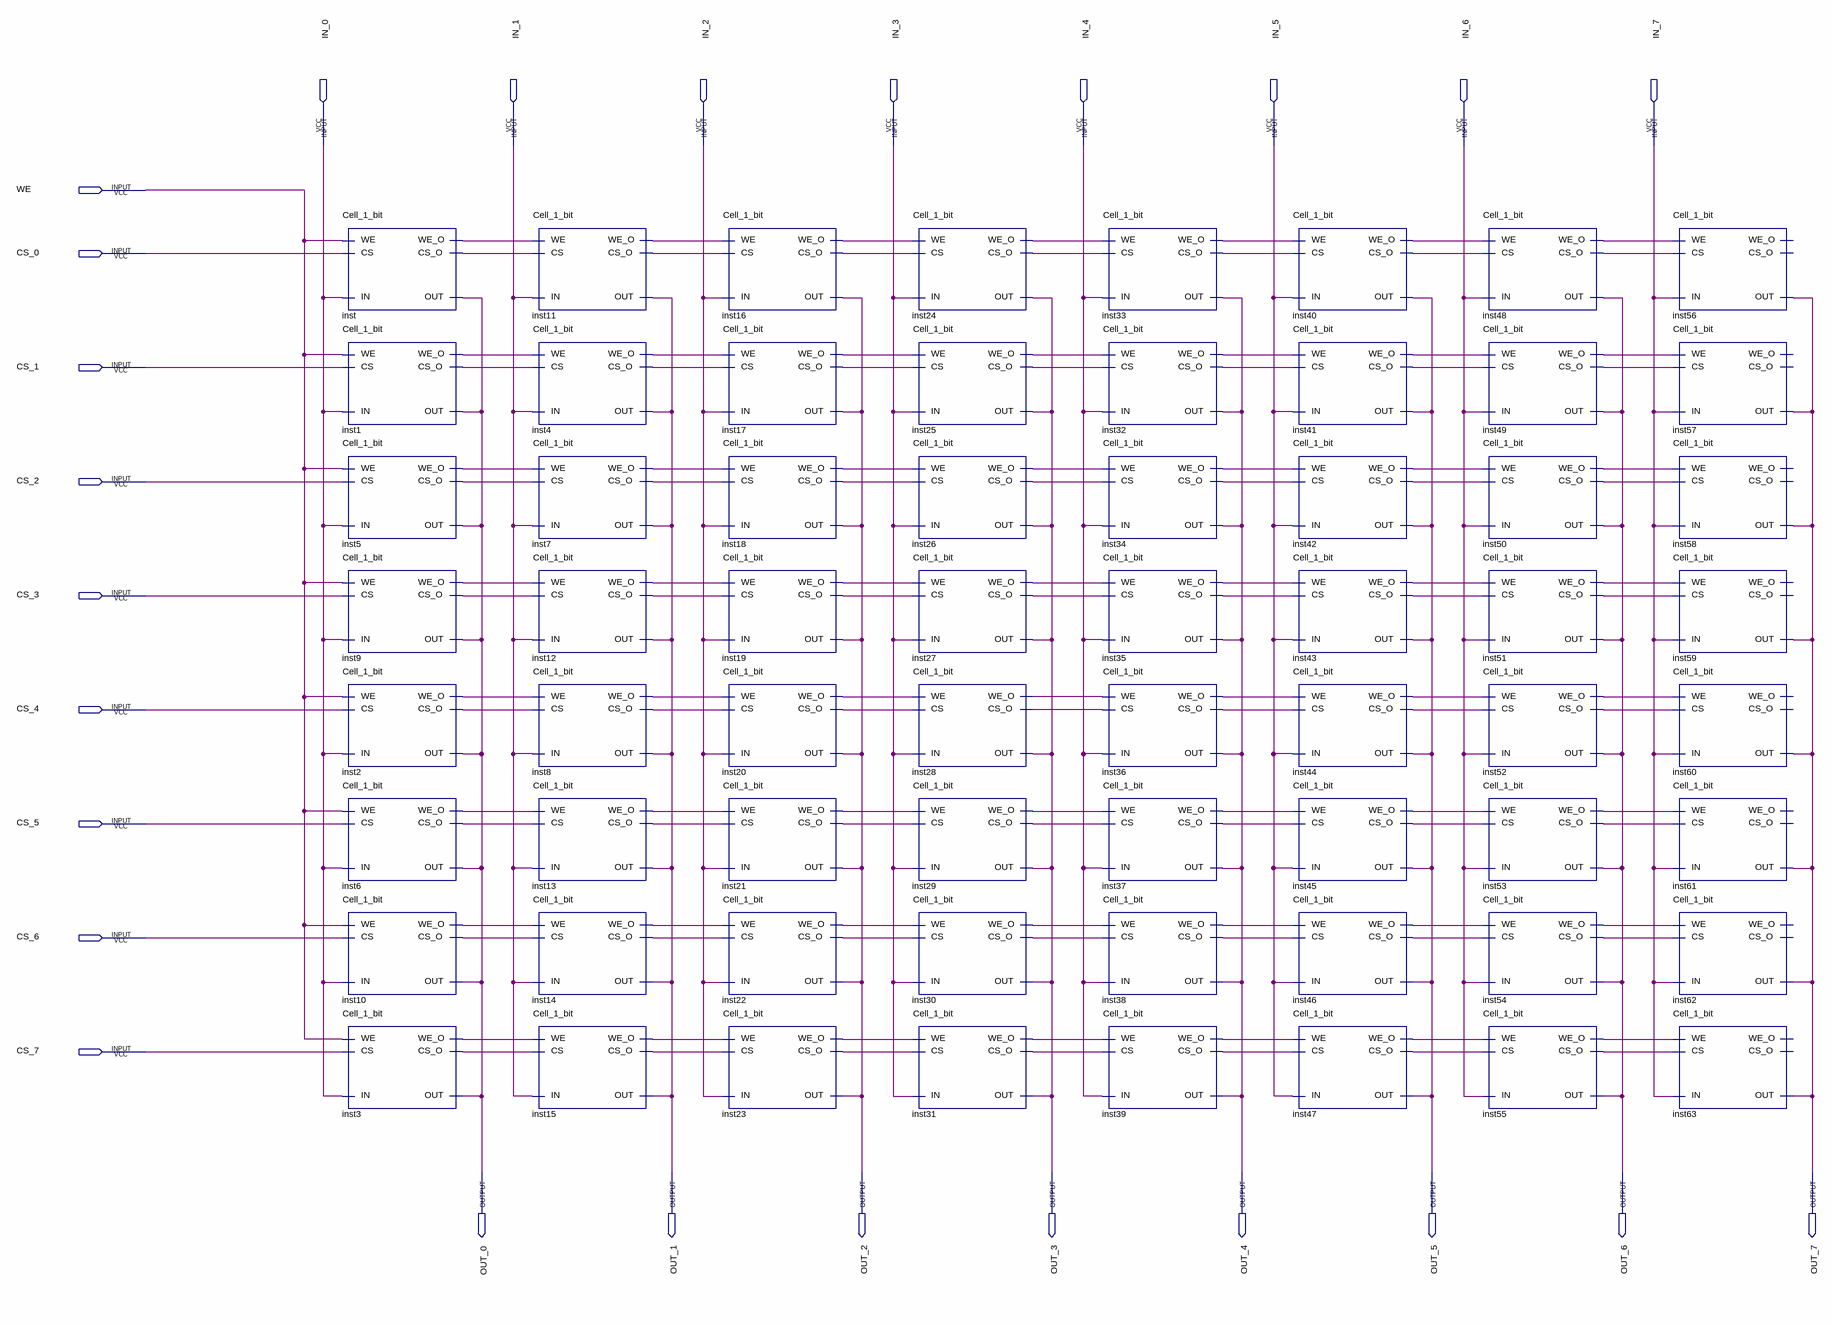
[diagram p0: schematic sheet]
// Quartus schematic Cell_8x8_bits.bdf as structural Verilog: 64 symbols, 25 pins
module Cell_8x8_bits (
  input  IN_0,
  input  IN_1,
  input  IN_2,
  input  IN_3,
  input  IN_4,
  input  IN_5,
  input  IN_6,
  input  IN_7,
  input  WE,
  input  CS_0,
  input  CS_1,
  input  CS_2,
  input  CS_3,
  input  CS_4,
  input  CS_5,
  input  CS_6,
  input  CS_7,
  output OUT_0,
  output OUT_1,
  output OUT_2,
  output OUT_3,
  output OUT_4,
  output OUT_5,
  output OUT_6,
  output OUT_7
);

  wire inst1_cs_o, inst1_we_o, inst2_cs_o, inst2_we_o, inst3_cs_o, inst3_we_o, inst4_cs_o, inst4_we_o,
       inst5_cs_o, inst5_we_o, inst6_cs_o, inst6_we_o, inst7_cs_o, inst7_we_o, inst8_cs_o, inst8_we_o,
       inst9_cs_o, inst9_we_o, inst10_cs_o, inst10_we_o, inst11_cs_o, inst11_we_o, inst12_cs_o, inst12_we_o,
       inst13_cs_o, inst13_we_o, inst14_cs_o, inst14_we_o, inst15_cs_o, inst15_we_o, inst16_cs_o,
       inst16_we_o, inst17_cs_o, inst17_we_o, inst18_cs_o, inst18_we_o, inst19_cs_o, inst19_we_o,
       inst20_cs_o, inst20_we_o, inst21_cs_o, inst21_we_o, inst22_cs_o, inst22_we_o, inst23_cs_o,
       inst23_we_o, inst24_cs_o, inst24_we_o, inst25_cs_o, inst25_we_o, inst26_cs_o, inst26_we_o,
       inst27_cs_o, inst27_we_o, inst28_cs_o, inst28_we_o, inst29_cs_o, inst29_we_o, inst30_cs_o,
       inst30_we_o, inst31_cs_o, inst31_we_o, inst32_cs_o, inst32_we_o, inst33_cs_o, inst33_we_o,
       inst34_cs_o, inst34_we_o, inst35_cs_o, inst35_we_o, inst36_cs_o, inst36_we_o, inst37_cs_o,
       inst37_we_o, inst38_cs_o, inst38_we_o, inst39_cs_o, inst39_we_o, inst40_cs_o, inst40_we_o,
       inst41_cs_o, inst41_we_o, inst42_cs_o, inst42_we_o, inst43_cs_o, inst43_we_o, inst44_cs_o,
       inst44_we_o, inst45_cs_o, inst45_we_o, inst46_cs_o, inst46_we_o, inst47_cs_o, inst47_we_o,
       inst48_cs_o, inst48_we_o, inst49_cs_o, inst49_we_o, inst50_cs_o, inst50_we_o, inst51_cs_o,
       inst51_we_o, inst52_cs_o, inst52_we_o, inst53_cs_o, inst53_we_o, inst54_cs_o, inst54_we_o,
       inst55_cs_o, inst55_we_o, inst_cs_o, inst_we_o;

  Cell_1_bit inst (.WE(WE), .CS(CS_0), .IN(IN_0), .WE_O(inst_we_o), .CS_O(inst_cs_o), .OUT(OUT_0));
  Cell_1_bit inst1 (.WE(WE), .CS(CS_1), .IN(IN_0), .WE_O(inst1_we_o), .CS_O(inst1_cs_o), .OUT(OUT_0));
  Cell_1_bit inst5 (.WE(WE), .CS(CS_2), .IN(IN_0), .WE_O(inst5_we_o), .CS_O(inst5_cs_o), .OUT(OUT_0));
  Cell_1_bit inst9 (.WE(WE), .CS(CS_3), .IN(IN_0), .WE_O(inst9_we_o), .CS_O(inst9_cs_o), .OUT(OUT_0));
  Cell_1_bit inst2 (.WE(WE), .CS(CS_4), .IN(IN_0), .WE_O(inst2_we_o), .CS_O(inst2_cs_o), .OUT(OUT_0));
  Cell_1_bit inst6 (.WE(WE), .CS(CS_5), .IN(IN_0), .WE_O(inst6_we_o), .CS_O(inst6_cs_o), .OUT(OUT_0));
  Cell_1_bit inst10 (.WE(WE), .CS(CS_6), .IN(IN_0), .WE_O(inst10_we_o), .CS_O(inst10_cs_o), .OUT(OUT_0));
  Cell_1_bit inst3 (.WE(WE), .CS(CS_7), .IN(IN_0), .WE_O(inst3_we_o), .CS_O(inst3_cs_o), .OUT(OUT_0));
  Cell_1_bit inst11 (.WE(inst_we_o), .CS(inst_cs_o), .IN(IN_1), .WE_O(inst11_we_o), .CS_O(inst11_cs_o), .OUT(OUT_1));
  Cell_1_bit inst4 (.WE(inst1_we_o), .CS(inst1_cs_o), .IN(IN_1), .WE_O(inst4_we_o), .CS_O(inst4_cs_o), .OUT(OUT_1));
  Cell_1_bit inst7 (.WE(inst5_we_o), .CS(inst5_cs_o), .IN(IN_1), .WE_O(inst7_we_o), .CS_O(inst7_cs_o), .OUT(OUT_1));
  Cell_1_bit inst12 (.WE(inst9_we_o), .CS(inst9_cs_o), .IN(IN_1), .WE_O(inst12_we_o), .CS_O(inst12_cs_o), .OUT(OUT_1));
  Cell_1_bit inst8 (.WE(inst2_we_o), .CS(inst2_cs_o), .IN(IN_1), .WE_O(inst8_we_o), .CS_O(inst8_cs_o), .OUT(OUT_1));
  Cell_1_bit inst13 (.WE(inst6_we_o), .CS(inst6_cs_o), .IN(IN_1), .WE_O(inst13_we_o), .CS_O(inst13_cs_o), .OUT(OUT_1));
  Cell_1_bit inst14 (
    .WE(inst10_we_o), .CS(inst10_cs_o), .IN(IN_1), .WE_O(inst14_we_o), .CS_O(inst14_cs_o), .OUT(OUT_1));
  Cell_1_bit inst15 (.WE(inst3_we_o), .CS(inst3_cs_o), .IN(IN_1), .WE_O(inst15_we_o), .CS_O(inst15_cs_o), .OUT(OUT_1));
  Cell_1_bit inst16 (
    .WE(inst11_we_o), .CS(inst11_cs_o), .IN(IN_2), .WE_O(inst16_we_o), .CS_O(inst16_cs_o), .OUT(OUT_2));
  Cell_1_bit inst17 (.WE(inst4_we_o), .CS(inst4_cs_o), .IN(IN_2), .WE_O(inst17_we_o), .CS_O(inst17_cs_o), .OUT(OUT_2));
  Cell_1_bit inst18 (.WE(inst7_we_o), .CS(inst7_cs_o), .IN(IN_2), .WE_O(inst18_we_o), .CS_O(inst18_cs_o), .OUT(OUT_2));
  Cell_1_bit inst19 (
    .WE(inst12_we_o), .CS(inst12_cs_o), .IN(IN_2), .WE_O(inst19_we_o), .CS_O(inst19_cs_o), .OUT(OUT_2));
  Cell_1_bit inst20 (.WE(inst8_we_o), .CS(inst8_cs_o), .IN(IN_2), .WE_O(inst20_we_o), .CS_O(inst20_cs_o), .OUT(OUT_2));
  Cell_1_bit inst21 (
    .WE(inst13_we_o), .CS(inst13_cs_o), .IN(IN_2), .WE_O(inst21_we_o), .CS_O(inst21_cs_o), .OUT(OUT_2));
  Cell_1_bit inst22 (
    .WE(inst14_we_o), .CS(inst14_cs_o), .IN(IN_2), .WE_O(inst22_we_o), .CS_O(inst22_cs_o), .OUT(OUT_2));
  Cell_1_bit inst23 (
    .WE(inst15_we_o), .CS(inst15_cs_o), .IN(IN_2), .WE_O(inst23_we_o), .CS_O(inst23_cs_o), .OUT(OUT_2));
  Cell_1_bit inst24 (
    .WE(inst16_we_o), .CS(inst16_cs_o), .IN(IN_3), .WE_O(inst24_we_o), .CS_O(inst24_cs_o), .OUT(OUT_3));
  Cell_1_bit inst25 (
    .WE(inst17_we_o), .CS(inst17_cs_o), .IN(IN_3), .WE_O(inst25_we_o), .CS_O(inst25_cs_o), .OUT(OUT_3));
  Cell_1_bit inst26 (
    .WE(inst18_we_o), .CS(inst18_cs_o), .IN(IN_3), .WE_O(inst26_we_o), .CS_O(inst26_cs_o), .OUT(OUT_3));
  Cell_1_bit inst27 (
    .WE(inst19_we_o), .CS(inst19_cs_o), .IN(IN_3), .WE_O(inst27_we_o), .CS_O(inst27_cs_o), .OUT(OUT_3));
  Cell_1_bit inst28 (
    .WE(inst20_we_o), .CS(inst20_cs_o), .IN(IN_3), .WE_O(inst28_we_o), .CS_O(inst28_cs_o), .OUT(OUT_3));
  Cell_1_bit inst29 (
    .WE(inst21_we_o), .CS(inst21_cs_o), .IN(IN_3), .WE_O(inst29_we_o), .CS_O(inst29_cs_o), .OUT(OUT_3));
  Cell_1_bit inst30 (
    .WE(inst22_we_o), .CS(inst22_cs_o), .IN(IN_3), .WE_O(inst30_we_o), .CS_O(inst30_cs_o), .OUT(OUT_3));
  Cell_1_bit inst31 (
    .WE(inst23_we_o), .CS(inst23_cs_o), .IN(IN_3), .WE_O(inst31_we_o), .CS_O(inst31_cs_o), .OUT(OUT_3));
  Cell_1_bit inst33 (
    .WE(inst24_we_o), .CS(inst24_cs_o), .IN(IN_4), .WE_O(inst33_we_o), .CS_O(inst33_cs_o), .OUT(OUT_4));
  Cell_1_bit inst32 (
    .WE(inst25_we_o), .CS(inst25_cs_o), .IN(IN_4), .WE_O(inst32_we_o), .CS_O(inst32_cs_o), .OUT(OUT_4));
  Cell_1_bit inst34 (
    .WE(inst26_we_o), .CS(inst26_cs_o), .IN(IN_4), .WE_O(inst34_we_o), .CS_O(inst34_cs_o), .OUT(OUT_4));
  Cell_1_bit inst35 (
    .WE(inst27_we_o), .CS(inst27_cs_o), .IN(IN_4), .WE_O(inst35_we_o), .CS_O(inst35_cs_o), .OUT(OUT_4));
  Cell_1_bit inst36 (
    .WE(inst28_we_o), .CS(inst28_cs_o), .IN(IN_4), .WE_O(inst36_we_o), .CS_O(inst36_cs_o), .OUT(OUT_4));
  Cell_1_bit inst37 (
    .WE(inst29_we_o), .CS(inst29_cs_o), .IN(IN_4), .WE_O(inst37_we_o), .CS_O(inst37_cs_o), .OUT(OUT_4));
  Cell_1_bit inst38 (
    .WE(inst30_we_o), .CS(inst30_cs_o), .IN(IN_4), .WE_O(inst38_we_o), .CS_O(inst38_cs_o), .OUT(OUT_4));
  Cell_1_bit inst39 (
    .WE(inst31_we_o), .CS(inst31_cs_o), .IN(IN_4), .WE_O(inst39_we_o), .CS_O(inst39_cs_o), .OUT(OUT_4));
  Cell_1_bit inst40 (
    .WE(inst33_we_o), .CS(inst33_cs_o), .IN(IN_5), .WE_O(inst40_we_o), .CS_O(inst40_cs_o), .OUT(OUT_5));
  Cell_1_bit inst41 (
    .WE(inst32_we_o), .CS(inst32_cs_o), .IN(IN_5), .WE_O(inst41_we_o), .CS_O(inst41_cs_o), .OUT(OUT_5));
  Cell_1_bit inst42 (
    .WE(inst34_we_o), .CS(inst34_cs_o), .IN(IN_5), .WE_O(inst42_we_o), .CS_O(inst42_cs_o), .OUT(OUT_5));
  Cell_1_bit inst43 (
    .WE(inst35_we_o), .CS(inst35_cs_o), .IN(IN_5), .WE_O(inst43_we_o), .CS_O(inst43_cs_o), .OUT(OUT_5));
  Cell_1_bit inst44 (
    .WE(inst36_we_o), .CS(inst36_cs_o), .IN(IN_5), .WE_O(inst44_we_o), .CS_O(inst44_cs_o), .OUT(OUT_5));
  Cell_1_bit inst45 (
    .WE(inst37_we_o), .CS(inst37_cs_o), .IN(IN_5), .WE_O(inst45_we_o), .CS_O(inst45_cs_o), .OUT(OUT_5));
  Cell_1_bit inst46 (
    .WE(inst38_we_o), .CS(inst38_cs_o), .IN(IN_5), .WE_O(inst46_we_o), .CS_O(inst46_cs_o), .OUT(OUT_5));
  Cell_1_bit inst47 (
    .WE(inst39_we_o), .CS(inst39_cs_o), .IN(IN_5), .WE_O(inst47_we_o), .CS_O(inst47_cs_o), .OUT(OUT_5));
  Cell_1_bit inst48 (
    .WE(inst40_we_o), .CS(inst40_cs_o), .IN(IN_6), .WE_O(inst48_we_o), .CS_O(inst48_cs_o), .OUT(OUT_6));
  Cell_1_bit inst49 (
    .WE(inst41_we_o), .CS(inst41_cs_o), .IN(IN_6), .WE_O(inst49_we_o), .CS_O(inst49_cs_o), .OUT(OUT_6));
  Cell_1_bit inst50 (
    .WE(inst42_we_o), .CS(inst42_cs_o), .IN(IN_6), .WE_O(inst50_we_o), .CS_O(inst50_cs_o), .OUT(OUT_6));
  Cell_1_bit inst51 (
    .WE(inst43_we_o), .CS(inst43_cs_o), .IN(IN_6), .WE_O(inst51_we_o), .CS_O(inst51_cs_o), .OUT(OUT_6));
  Cell_1_bit inst52 (
    .WE(inst44_we_o), .CS(inst44_cs_o), .IN(IN_6), .WE_O(inst52_we_o), .CS_O(inst52_cs_o), .OUT(OUT_6));
  Cell_1_bit inst53 (
    .WE(inst45_we_o), .CS(inst45_cs_o), .IN(IN_6), .WE_O(inst53_we_o), .CS_O(inst53_cs_o), .OUT(OUT_6));
  Cell_1_bit inst54 (
    .WE(inst46_we_o), .CS(inst46_cs_o), .IN(IN_6), .WE_O(inst54_we_o), .CS_O(inst54_cs_o), .OUT(OUT_6));
  Cell_1_bit inst55 (
    .WE(inst47_we_o), .CS(inst47_cs_o), .IN(IN_6), .WE_O(inst55_we_o), .CS_O(inst55_cs_o), .OUT(OUT_6));
  Cell_1_bit inst56 (.WE(inst48_we_o), .CS(inst48_cs_o), .IN(IN_7), .OUT(OUT_7));  // open: WE_O, CS_O
  Cell_1_bit inst57 (.WE(inst49_we_o), .CS(inst49_cs_o), .IN(IN_7), .OUT(OUT_7));  // open: WE_O, CS_O
  Cell_1_bit inst58 (.WE(inst50_we_o), .CS(inst50_cs_o), .IN(IN_7), .OUT(OUT_7));  // open: WE_O, CS_O
  Cell_1_bit inst59 (.WE(inst51_we_o), .CS(inst51_cs_o), .IN(IN_7), .OUT(OUT_7));  // open: WE_O, CS_O
  Cell_1_bit inst60 (.WE(inst52_we_o), .CS(inst52_cs_o), .IN(IN_7), .OUT(OUT_7));  // open: WE_O, CS_O
  Cell_1_bit inst61 (.WE(inst53_we_o), .CS(inst53_cs_o), .IN(IN_7), .OUT(OUT_7));  // open: WE_O, CS_O
  Cell_1_bit inst62 (.WE(inst54_we_o), .CS(inst54_cs_o), .IN(IN_7), .OUT(OUT_7));  // open: WE_O, CS_O
  Cell_1_bit inst63 (.WE(inst55_we_o), .CS(inst55_cs_o), .IN(IN_7), .OUT(OUT_7));  // open: WE_O, CS_O
endmodule
